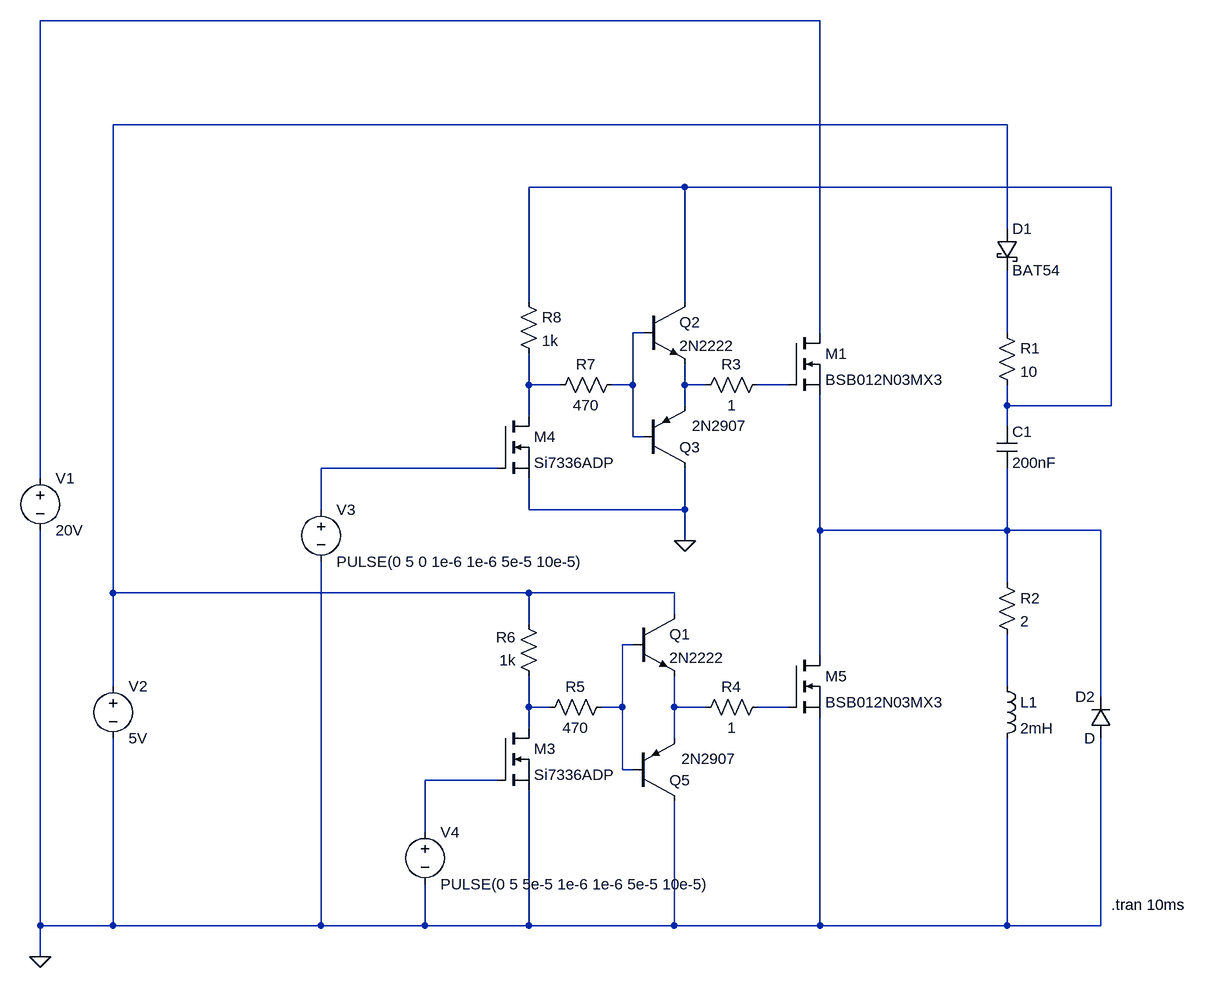
[diagram p0: schematic BootstrapDriver.asc]
BootstrapDriver.asc, the LTspice schematic file:
Version 4
SHEET 1 964 1060
WIRE 272 -400 -928 -400
WIRE 560 -240 -816 -240
WIRE 64 -144 -176 -144
WIRE 720 -144 64 -144
WIRE 560 -80 560 -240
WIRE -176 32 -176 -144
WIRE 64 32 64 -144
WIRE 0 80 -16 80
WIRE 272 80 272 -400
WIRE 560 80 560 -16
WIRE -176 160 -176 112
WIRE -128 160 -176 160
WIRE -16 160 -16 80
WIRE -16 160 -48 160
WIRE 64 160 64 128
WIRE 96 160 64 160
WIRE 224 160 176 160
WIRE 64 192 64 160
WIRE 560 192 560 160
WIRE 720 192 720 -144
WIRE 720 192 560 192
WIRE -176 208 -176 160
WIRE 560 224 560 192
WIRE -16 240 -16 160
WIRE 0 240 -16 240
WIRE -224 288 -496 288
WIRE -928 304 -928 -400
WIRE -496 352 -496 288
WIRE -176 352 -176 304
WIRE 64 352 64 288
WIRE 64 352 -176 352
WIRE 272 384 272 176
WIRE 560 384 560 288
WIRE 560 384 272 384
WIRE 704 384 560 384
WIRE 64 400 64 352
WIRE 560 464 560 384
WIRE -816 480 -816 -240
WIRE -176 480 -816 480
WIRE 48 480 -176 480
WIRE 48 512 48 480
WIRE -176 528 -176 480
WIRE -16 560 -32 560
WIRE 272 576 272 384
WIRE -816 624 -816 480
WIRE 560 624 560 544
WIRE 704 640 704 384
WIRE -176 656 -176 608
WIRE -144 656 -176 656
WIRE -32 656 -32 560
WIRE -32 656 -64 656
WIRE 48 656 48 608
WIRE 96 656 48 656
WIRE 224 656 176 656
WIRE -176 688 -176 656
WIRE 48 704 48 656
WIRE -32 752 -32 656
WIRE -16 752 -32 752
WIRE -224 768 -336 768
WIRE -336 848 -336 768
WIRE -928 992 -928 384
WIRE -816 992 -816 704
WIRE -816 992 -928 992
WIRE -496 992 -496 432
WIRE -496 992 -816 992
WIRE -336 992 -336 928
WIRE -336 992 -496 992
WIRE -176 992 -176 784
WIRE -176 992 -336 992
WIRE 48 992 48 800
WIRE 48 992 -176 992
WIRE 272 992 272 672
WIRE 272 992 48 992
WIRE 560 992 560 704
WIRE 560 992 272 992
WIRE 704 992 704 704
WIRE 704 992 560 992
WIRE -928 1040 -928 992
FLAG -928 1040 0
FLAG 64 400 0
SYMBOL nmos 224 80 R0
SYMATTR InstName M1
SYMATTR Value BSB012N03MX3
SYMBOL voltage -928 288 R0
WINDOW 123 0 0 Left 0
WINDOW 39 0 0 Left 0
SYMATTR InstName V1
SYMATTR Value 20V
SYMBOL voltage -816 608 R0
WINDOW 123 0 0 Left 0
WINDOW 39 0 0 Left 0
SYMATTR InstName V2
SYMATTR Value 5V
SYMBOL res 544 64 R0
SYMATTR InstName R1
SYMATTR Value 10
SYMBOL cap 544 224 R0
SYMATTR InstName C1
SYMATTR Value 200nF
SYMBOL schottky 544 -80 R0
SYMATTR InstName D1
SYMATTR Value BAT54
SYMATTR Description Diode
SYMATTR Type diode
SYMBOL res 544 448 R0
SYMATTR InstName R2
SYMATTR Value 2
SYMBOL ind 544 608 R0
SYMATTR InstName L1
SYMATTR Value 2mH
SYMBOL res 192 144 R90
WINDOW 0 0 56 VBottom 2
WINDOW 3 32 56 VTop 2
SYMATTR InstName R3
SYMATTR Value 1
SYMBOL res 192 640 R90
WINDOW 0 0 56 VBottom 2
WINDOW 3 32 56 VTop 2
SYMATTR InstName R4
SYMATTR Value 1
SYMBOL npn -16 512 R0
SYMATTR InstName Q1
SYMATTR Value 2N2222
SYMBOL npn 0 32 R0
SYMATTR InstName Q2
SYMATTR Value 2N2222
SYMBOL pnp 0 288 M180
WINDOW 3 75 65 Left 2
SYMATTR Value 2N2907
SYMATTR InstName Q3
SYMBOL res -48 640 R90
WINDOW 0 0 56 VBottom 2
WINDOW 3 32 56 VTop 2
SYMATTR InstName R5
SYMATTR Value 470
SYMBOL res -160 624 R180
WINDOW 0 36 76 Left 2
WINDOW 3 36 40 Left 2
SYMATTR InstName R6
SYMATTR Value 1k
SYMBOL res -144 176 R270
WINDOW 0 32 56 VTop 2
WINDOW 3 0 56 VBottom 2
SYMATTR InstName R7
SYMATTR Value 470
SYMBOL res -192 16 R0
SYMATTR InstName R8
SYMATTR Value 1k
SYMBOL nmos -224 688 R0
SYMATTR InstName M3
SYMATTR Value Si7336ADP
SYMBOL nmos -224 208 R0
SYMATTR InstName M4
SYMATTR Value Si7336ADP
SYMBOL voltage -496 336 R0
WINDOW 123 0 0 Left 0
WINDOW 39 0 0 Left 0
SYMATTR InstName V3
SYMATTR Value PULSE(0 5 0 1e-6 1e-6 5e-5 10e-5)
SYMBOL voltage -336 832 R0
WINDOW 123 0 0 Left 0
WINDOW 39 0 0 Left 0
SYMATTR InstName V4
SYMATTR Value PULSE(0 5 5e-5 1e-6 1e-6 5e-5 10e-5)
SYMBOL nmos 224 576 R0
SYMATTR InstName M5
SYMATTR Value BSB012N03MX3
SYMBOL pnp -16 800 M180
WINDOW 3 75 65 Left 2
SYMATTR Value 2N2907
SYMATTR InstName Q5
SYMBOL diode 720 704 R180
WINDOW 0 24 64 Left 2
WINDOW 3 24 0 Left 2
SYMATTR InstName D2
TEXT 720 960 Left 2 !.tran 10ms

The netlist it stands for:
* BootstrapDriver.asc
M1 N001 N008 N010 N010 BSB012N03MX3
V1 N001 0 20V
V2 N002 0 5V
R1 N005 N003 10
C1 N003 N010 200nF
D1 N002 N005 BAT54
R2 N010 N012 2
L1 N012 0 2mH
R3 N008 N007 1
R4 N015 N014 1
Q1 N002 N011 N014 0 2N2222
Q2 N003 N004 N007 0 2N2222
Q3 0 N004 N007 0 2N2907
R5 N011 N013 470
R6 N013 N002 1k
R7 N006 N004 470
R8 N003 N006 1k
M3 N013 N016 0 0 Si7336ADP
M4 N006 N009 0 0 Si7336ADP
V3 N009 0 PULSE(0 5 0 1e-6 1e-6 5e-5 10e-5)
V4 N016 0 PULSE(0 5 5e-5 1e-6 1e-6 5e-5 10e-5)
M5 N010 N015 0 0 BSB012N03MX3
Q5 0 N011 N014 0 2N2907
D2 0 N010 D
.model D D
.lib standard.dio
.model NPN NPN
.model PNP PNP
.lib standard.bjt
.model NMOS NMOS
.model PMOS PMOS
.lib standard.mos
.tran 10ms
.backanno
.end